# Altium schematic sheet Can_Interface.SchDoc
size A4; SheetNumber: 7; SheetTotal: 8
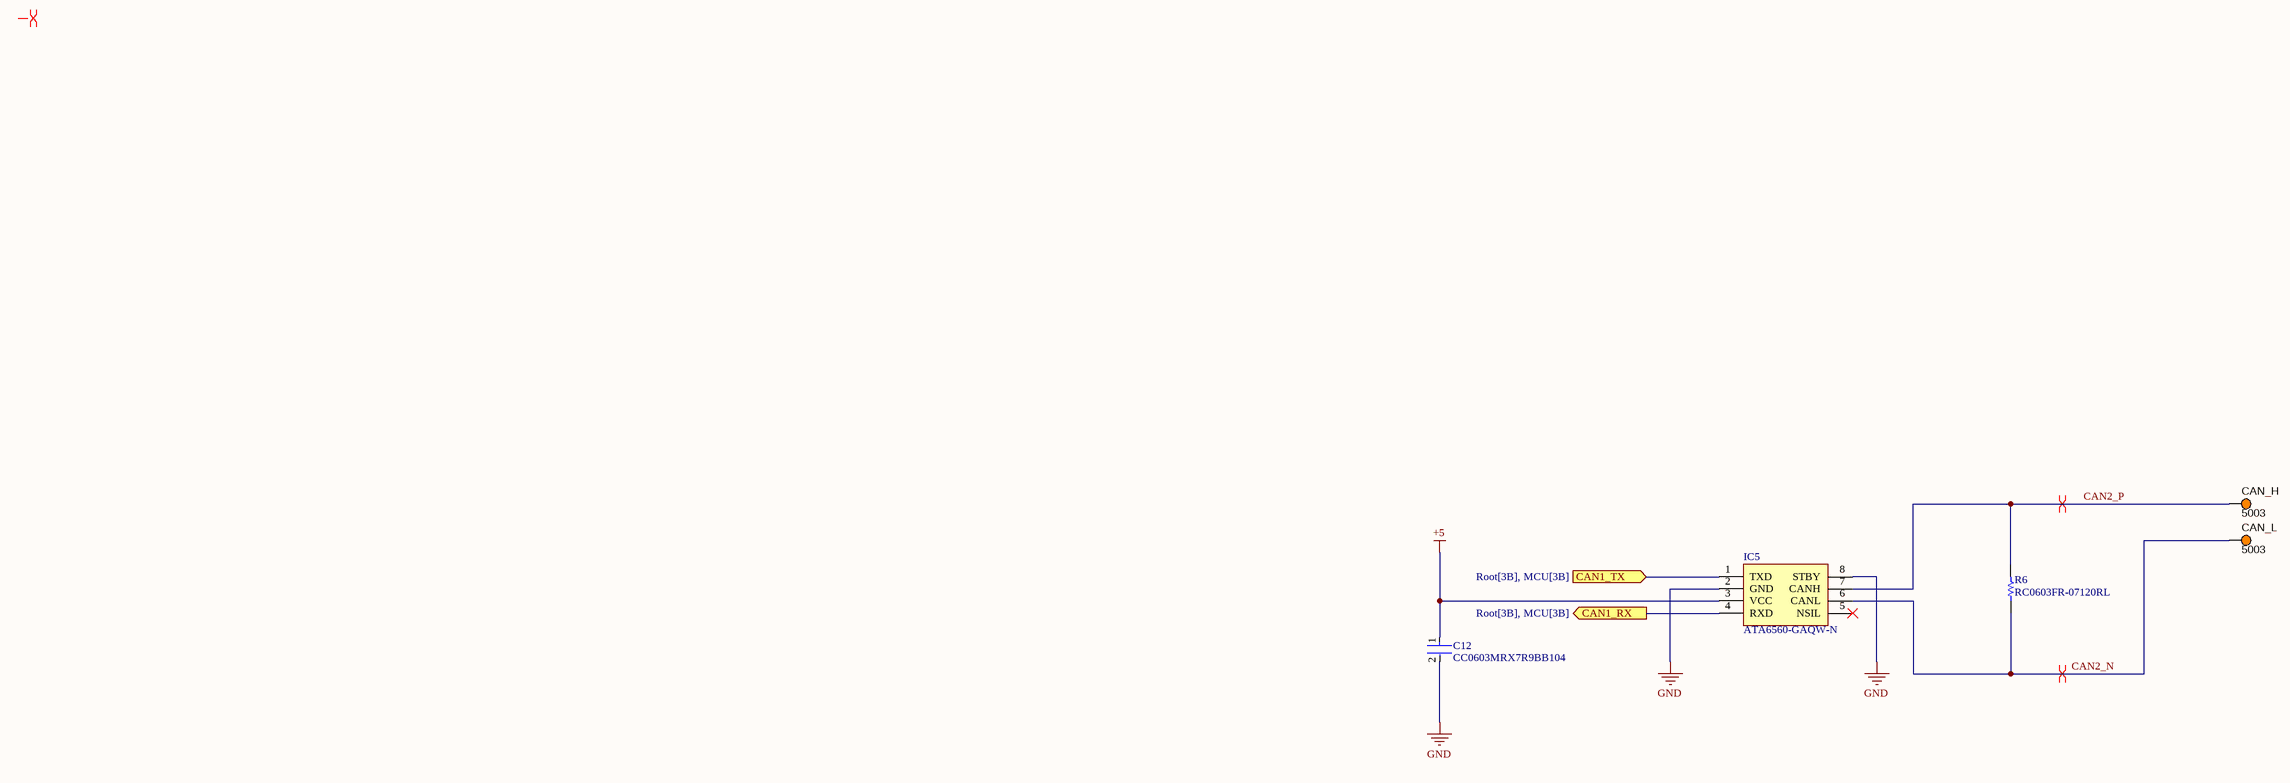
[diagram p0: Can_Interface.SchDoc]

## Parts
C12  CC0603MRX7R9BB104  [FP-CC0603-DA-MFG]
CAN_H  5003  [KSTN-5003]
CAN_L  5003  [KSTN-5003]
IC5  ATA6560-GAQW-N  [SOIC8_4P9X3P9MC_MCH]
R6  RC0603FR-07120RL  [RESC1608X55X25NL10T15]

## Ports
CAN1_RX (out, see Root[3B], MCU[3B]), CAN1_TX (in, see Root[3B], MCU[3B])

## Nets
+5: C12.1 IC5.3(VCC)
GND: C12.2 IC5.2(GND) IC5.8(STBY)
CAN1_RX: IC5.4(RXD) ; port CAN1_RX
CAN1_TX: IC5.1(TXD) ; port CAN1_TX
CAN2_N: CAN_L.1 IC5.6(CANL) R6.1
CAN2_P: CAN_H.1 IC5.7(CANH) R6.2

Not connected (* = marked no-connect by the designer): IC5 5(NSIL)*

## Layout directives
differential pair: (no net found under the mark), CAN2_N, CAN2_P

## Library data of the parts
C12 = CMP-03422-000537-1: CAP CER 0.1UF 50V X7R 0603; Manufacturer: YAGEO; Material: Ceramic; Capacitance: 100 nF; Temperature Coefficient: 15%; Tolerance: 0.2; Value: 100 nF; Temperature Range Low: -55°C; Height: 0.9mm; Temperature Range High: +125°C; Category: Cap; Package: CC0603-DA; Mouser Description: Cap Ceramic 50V 20% +Tol 20% -Tol X7R 15% TC 0.1uF SMD 0603; Temperature Characteristic: X7R; Footprint Url: http://www.yageo.com/exep/pages/download/literatures/UPY-C_GEN_24.pdf; Octopart: https://octopart.com/cc0603mrx7r9bb104-yageo-67308423; RoHS: TRUE; Voltage: 50 V; Manufacturer Part Number: CC0603MRX7R9BB104; Lead Free: Yes; ComponentLink2URL: http://www.yageo.com/documents/recent/UPY-GPHC_X7R_6.3V-to-50V_18.pdf; ComponentLink2Description: Datasheet; Digikey Description: CAP CER 0.1UF 50V X7R 0603; Device Class L2: Capacitors; Automotive: No; Voltage Rating: 50 V; Temperature: -55°C to +125°C; Device Class L1: Passive Components; Device Class L3: Ceramic Capacitors
CAN_H CAN_L = CMP-002-00037-2: Test Point, Orange, Height 4.6 mm, Tail Length 3 mm, 1-Pin THD, RoHS; Manufacturer: Keystone; Colour: Orange; Packaging: Bulk; Package Description: 1-Pin Through Hole Device, Dia 2.54 mm; Pins: 1; Package Reference: 5003; Datasheet Version: Jun-15; Case/Package: 5003; Mounting Technology: TH; Connector Type: TestPoint; Diameter: 2.54mm; Contact Material: Bronze; Datasheet URL: http://keyelco.com/userAssets/file/M65p56.pdf; Manufacturer URL: http://www.keyelco.com/; Package Quantity: 10; Contact Plating: Tin; RoHS Compliant: True
IC5 = ATA6560-GAQW-N: Integrated Circuit; Manufacturer_Name: Microchip; Datasheet Link: https://mouser.componentsearchengine.com/Datasheets/1/ATA6560-GAQW-N.pdf; Height: 1.75mm; Manufacturer_Part_Number: ATA6560-GAQW-N; Mouser Part Number: 579-ATA6560-GAQW-N; Mouser Price/Stock: https://www.mouser.co.uk/ProductDetail/Microchip-Technology-Atmel/ATA6560-GAQW-N?qs=y6ZabgHbY%252By0WOzqKXUktg%3D%3D; Arrow Part Number: ATA6560-GAQW-N; Arrow Price/Stock: https://www.arrow.com/en/products/ata6560-gaqw-n/microchip-technology?region=nac
R6 = CMP-1659-00034-1: Chip Resistor, 120 Ohm, +/- 1%, 100 mW, -55 to 155 degC, 0603 (1608 Metric), RoHS, Tape and Reel; Nominal Vf: 2.1 V; Power Rating: 90 mW; Case\Package: 0603; Lens Style: Diffused; Viewing Angle: 160 degrees; Forward Current: 20 mA; Luminous Intensity: 80 mcd; Illumination Colour: Orange; Nominal Wavelength: 606 nm; Package Quantity: 3000; Radiation Hardening: No; ComponentLink2URL: http://www.yageo.com/documents/recent/PYu-RC_Group_51_RoHS_L_04.pdf; Mount: Surface Mount; ComponentLink1URL: http://www.yageo.com/; PackageReference: 0603; PackageDescription: 2-Pin Surface Mount Device, Body 1.6 x 0.8 mm; Min Operating Temperature: -40 degC; Colour: Orange; Case Code (Metric): 1608; Length: 1.6 mm; Width: 0.8 mm; Packaging: Tape and Reel; Case Code (Imperial): 0603; RoHSCompliant: true; Height: 0.6 mm; DatasheetVersion: Rev. 4, 02/2016; Pins: 2; ComponentLink1Description: Manufacturer URL; Forward Voltage: 2.1 V; Max Operating Temperature: 100 degC; REACH SVHC: Unknown; ComponentLink2Description: Datasheet